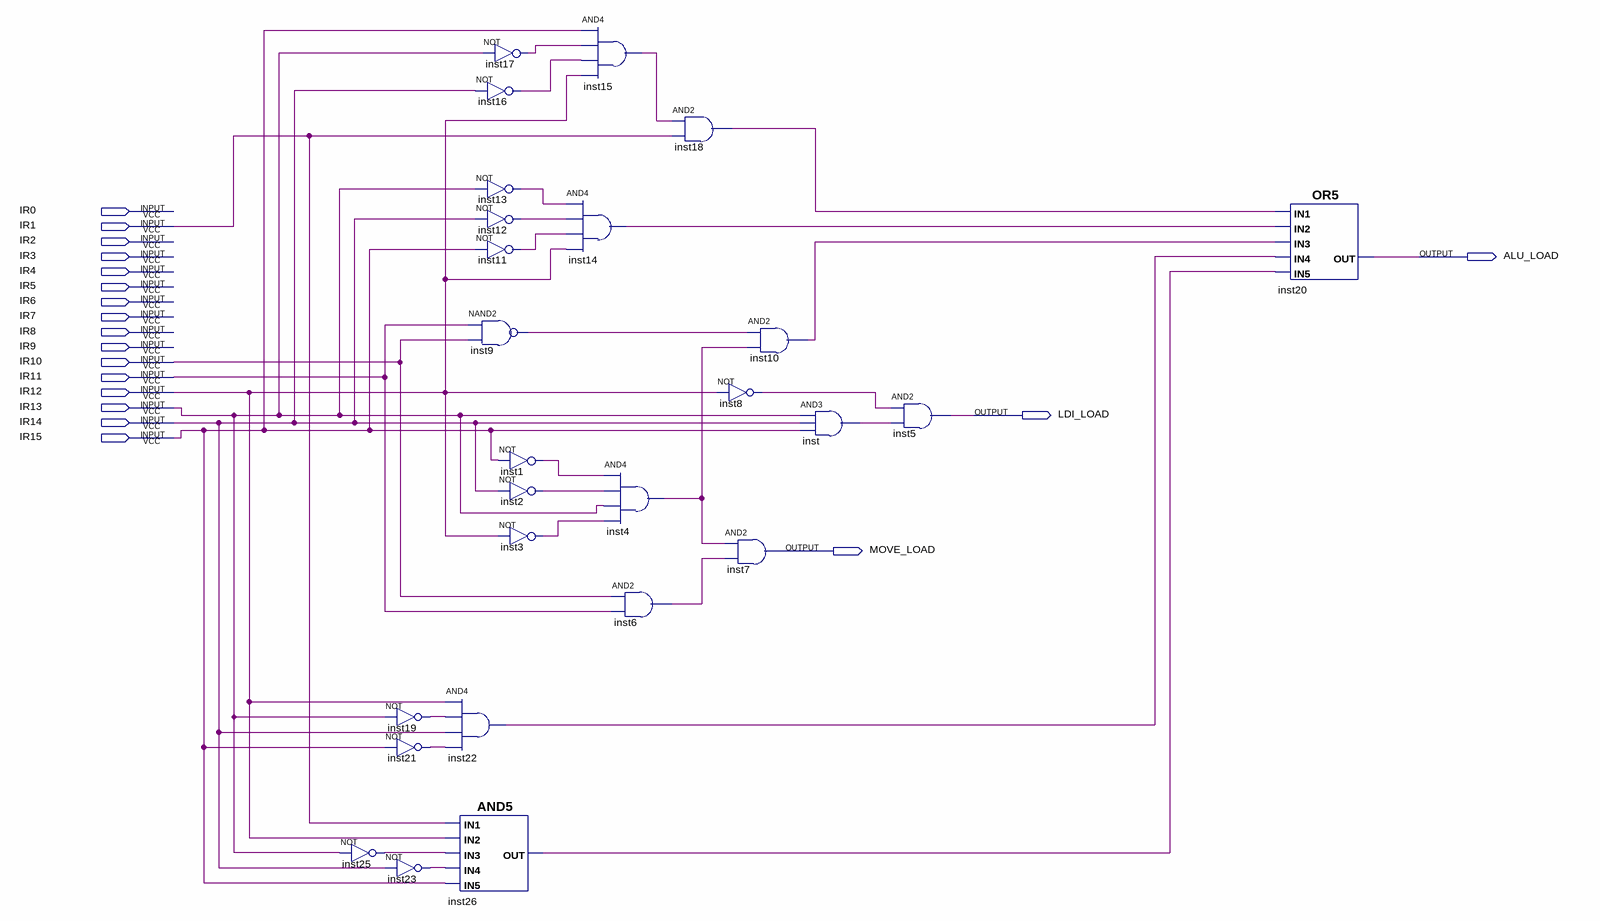
[diagram p0: schematic sheet]
// Quartus schematic LOAD_SELECT.bdf as structural Verilog: 26 symbols, 19 pins
module LOAD_SELECT (
  input  IR0,
  input  IR1,
  input  IR2,
  input  IR3,
  input  IR4,
  input  IR5,
  input  IR6,
  input  IR7,
  input  IR8,
  input  IR9,
  input  IR10,
  input  IR11,
  input  IR12,
  input  IR13,
  input  IR14,
  input  IR15,
  output ALU_LOAD,
  output LDI_LOAD,
  output MOVE_LOAD
);

  wire inst1_out, inst2_out, inst3_out, inst4_out, inst6_out, inst8_out, inst9_out, inst10_out, inst11_out,
       inst12_out, inst13_out, inst14_out, inst15_out, inst16_out, inst17_out, inst18_out, inst19_out,
       inst21_out, inst22_out, inst23_out, inst25_out, inst26_out, inst_out;

  not inst25 (inst25_out, IR13);
  not inst19 (inst19_out, IR13);
  not inst21 (inst21_out, IR15);
  not inst23 (inst23_out, IR14);
  not inst16 (inst16_out, IR14);
  not inst13 (inst13_out, IR13);
  not inst12 (inst12_out, IR14);
  not inst11 (inst11_out, IR15);
  nand inst9 (inst9_out, IR11, IR10);
  and inst22 (inst22_out, IR12, inst19_out, IR14, inst21_out);
  and inst26 (inst26_out, IR1, IR12, inst25_out, inst23_out, IR15);
  not inst17 (inst17_out, IR13);
  not inst1 (inst1_out, IR15);
  not inst2 (inst2_out, IR14);
  not inst3 (inst3_out, IR12);
  and inst15 (inst15_out, IR15, inst17_out, inst16_out, IR12);
  and inst14 (inst14_out, inst13_out, inst12_out, inst11_out, IR12);
  and inst4 (inst4_out, inst1_out, inst2_out, IR13, inst3_out);
  and inst6 (inst6_out, IR10, IR11);
  and inst18 (inst18_out, inst15_out, IR1);
  not inst8 (inst8_out, IR12);
  and inst10 (inst10_out, inst9_out, inst4_out);
  and inst7 (MOVE_LOAD, inst4_out, inst6_out);
  and inst (inst_out, IR13, IR14, IR15);
  and inst5 (LDI_LOAD, inst8_out, inst_out);
  or inst20 (ALU_LOAD, inst18_out, inst14_out, inst10_out, inst22_out, inst26_out);
endmodule
